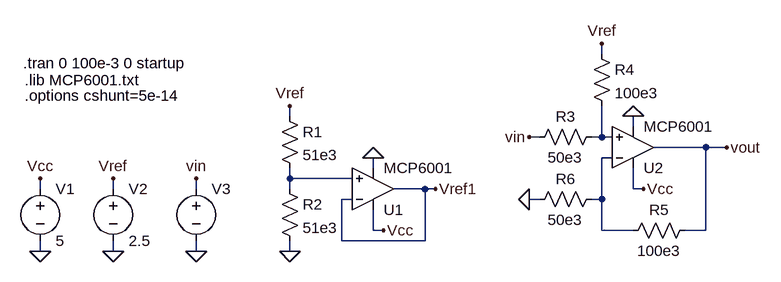
[diagram p0: schematic sigcond.asc]
sigcond.asc, the LTspice schematic file:
Version 4
SHEET 1 880 680
WIRE 464 16 464 0
WIRE -16 112 -16 96
WIRE 512 128 512 112
WIRE 368 144 352 144
WIRE 464 144 464 96
WIRE 464 144 448 144
WIRE 480 144 464 144
WIRE 624 160 544 160
WIRE 656 160 624 160
WIRE 480 176 464 176
WIRE 112 192 112 176
WIRE -16 208 -16 192
WIRE 80 208 -16 208
WIRE -400 224 -400 208
WIRE -288 224 -288 208
WIRE -160 224 -160 208
WIRE -16 224 -16 208
WIRE 192 224 144 224
WIRE 208 224 192 224
WIRE 512 224 512 192
WIRE 528 224 512 224
WIRE 80 240 64 240
WIRE 368 240 352 240
WIRE 464 240 464 176
WIRE 464 240 448 240
WIRE 112 288 112 256
WIRE 128 288 112 288
WIRE 464 288 464 240
WIRE 512 288 464 288
WIRE 624 288 624 160
WIRE 624 288 592 288
WIRE 64 304 64 240
WIRE 192 304 192 224
WIRE 192 304 64 304
WIRE -400 320 -400 304
WIRE -288 320 -288 304
WIRE -160 320 -160 304
WIRE -16 320 -16 304
FLAG -16 320 0
FLAG -400 320 0
FLAG -288 320 0
FLAG -288 208 Vref
FLAG -400 208 Vcc
FLAG -16 96 Vref
FLAG 128 288 Vcc
FLAG 112 176 0
FLAG 208 224 Vref1
FLAG 528 224 Vcc
FLAG 512 112 0
FLAG 464 0 Vref
FLAG -160 320 0
FLAG -160 208 vin
FLAG 352 144 vin
FLAG 352 240 0
FLAG 656 160 vout
SYMBOL res -32 96 R0
SYMATTR InstName R1
SYMATTR Value 51e3
SYMBOL res -32 208 R0
SYMATTR InstName R2
SYMATTR Value 51e3
SYMBOL OpAmps\\opamp2 112 288 M180
SYMATTR InstName U1
SYMATTR Value MCP6001
SYMBOL voltage -400 208 R0
WINDOW 123 0 0 Left 0
WINDOW 39 0 0 Left 0
SYMATTR InstName V1
SYMATTR Value 5
SYMBOL voltage -288 208 R0
WINDOW 123 0 0 Left 0
WINDOW 39 0 0 Left 0
SYMATTR InstName V2
SYMATTR Value 2.5
SYMBOL OpAmps\\opamp2 512 224 M180
SYMATTR InstName U2
SYMATTR Value MCP6001
SYMBOL res 464 128 R90
WINDOW 0 0 56 VBottom 2
WINDOW 3 32 56 VTop 2
SYMATTR InstName R3
SYMATTR Value 50e3
SYMBOL res 448 0 R0
SYMATTR InstName R4
SYMATTR Value 100e3
SYMBOL voltage -160 208 R0
WINDOW 3 24 96 Invisible 2
WINDOW 123 0 0 Left 0
WINDOW 39 0 0 Left 0
SYMATTR InstName V3
SYMATTR Value SINE(0 1 50)
SYMBOL res 496 304 R270
WINDOW 0 32 56 VTop 2
WINDOW 3 0 56 VBottom 2
SYMATTR InstName R5
SYMATTR Value 100e3
SYMBOL res 464 224 R90
WINDOW 0 0 56 VBottom 2
WINDOW 3 32 56 VTop 2
SYMATTR InstName R6
SYMATTR Value 50e3
TEXT -424 56 Left 2 !.lib MCP6001.txt
TEXT -426 30 Left 2 !.tran 0 100e-3 0 startup
TEXT -424 80 Left 2 !.options cshunt=5e-14

The netlist it stands for:
* sigcond.asc
R1 Vref N003 51e3
R2 N003 0 51e3
XU1 N003 Vref1 Vcc 0 Vref1 MCP6001  ; pins In+ In- V+ V- OUT
V1 Vcc 0 5
V2 Vref 0 2.5
XU2 N001 N002 Vcc 0 vout MCP6001  ; pins In+ In- V+ V- OUT
R3 N001 vin 50e3
R4 Vref N001 100e3
V3 vin 0 SINE(0 1 50)
R5 N002 vout 100e3
R6 N002 0 50e3
.lib MCP6001.txt
.tran 0 100e-3 0 startup
.options cshunt=5e-14
.backanno
.end